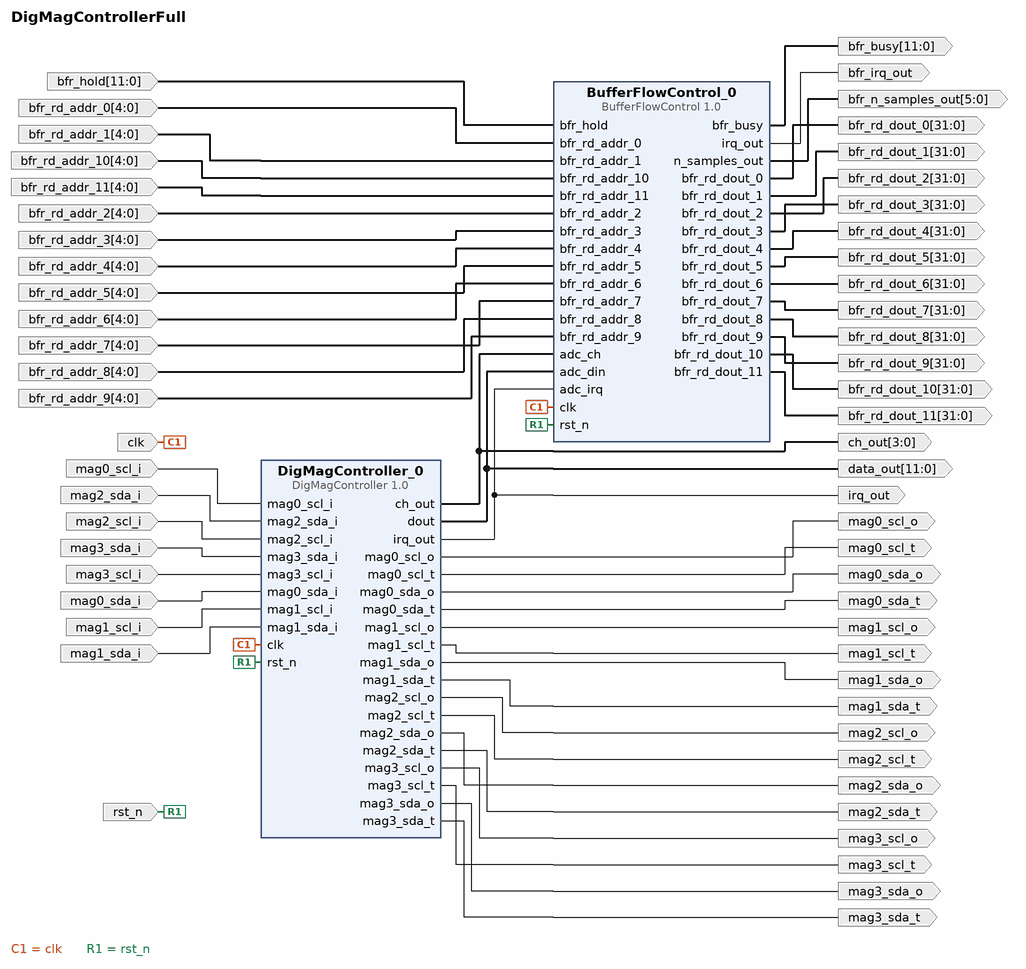
[diagram p0: block diagram of the top level]
# Vivado block design DigMagControllerFull, xczu3eg-sbva484-1-i, Vivado 2020.2
create_bd_design DigMagControllerFull

create_bd_port -dir O -from 11 -to 0 bfr_busy
create_bd_port -dir I -from 11 -to 0 bfr_hold
create_bd_port -dir O bfr_irq_out
create_bd_port -dir O -from 5 -to 0 bfr_n_samples_out
create_bd_port -dir I -from 4 -to 0 bfr_rd_addr_0
create_bd_port -dir I -from 4 -to 0 bfr_rd_addr_1
create_bd_port -dir I -from 4 -to 0 bfr_rd_addr_10
create_bd_port -dir I -from 4 -to 0 bfr_rd_addr_11
create_bd_port -dir I -from 4 -to 0 bfr_rd_addr_2
create_bd_port -dir I -from 4 -to 0 bfr_rd_addr_3
create_bd_port -dir I -from 4 -to 0 bfr_rd_addr_4
create_bd_port -dir I -from 4 -to 0 bfr_rd_addr_5
create_bd_port -dir I -from 4 -to 0 bfr_rd_addr_6
create_bd_port -dir I -from 4 -to 0 bfr_rd_addr_7
create_bd_port -dir I -from 4 -to 0 bfr_rd_addr_8
create_bd_port -dir I -from 4 -to 0 bfr_rd_addr_9
create_bd_port -dir O -from 31 -to 0 bfr_rd_dout_0
create_bd_port -dir O -from 31 -to 0 bfr_rd_dout_1
create_bd_port -dir O -from 31 -to 0 bfr_rd_dout_10
create_bd_port -dir O -from 31 -to 0 bfr_rd_dout_11
create_bd_port -dir O -from 31 -to 0 bfr_rd_dout_2
create_bd_port -dir O -from 31 -to 0 bfr_rd_dout_3
create_bd_port -dir O -from 31 -to 0 bfr_rd_dout_4
create_bd_port -dir O -from 31 -to 0 bfr_rd_dout_5
create_bd_port -dir O -from 31 -to 0 bfr_rd_dout_6
create_bd_port -dir O -from 31 -to 0 bfr_rd_dout_7
create_bd_port -dir O -from 31 -to 0 bfr_rd_dout_8
create_bd_port -dir O -from 31 -to 0 bfr_rd_dout_9
create_bd_port -dir O -from 3 -to 0 ch_out
create_bd_port -dir I -type clk clk
create_bd_port -dir O -from 11 -to 0 data_out
create_bd_port -dir O irq_out
create_bd_port -dir I -type rst rst_n
create_bd_port -dir O mag2_scl_t
create_bd_port -dir O mag2_sda_o
create_bd_port -dir O mag2_scl_o
create_bd_port -dir O mag0_scl_t
create_bd_port -dir O mag2_sda_t
create_bd_port -dir I mag0_sda_i
create_bd_port -dir I mag2_scl_i
create_bd_port -dir O mag3_sda_t
create_bd_port -dir I mag3_sda_i
create_bd_port -dir O mag0_sda_o
create_bd_port -dir O mag3_sda_o
create_bd_port -dir O mag3_scl_t
create_bd_port -dir O mag0_scl_o
create_bd_port -dir O mag3_scl_o
create_bd_port -dir O mag0_sda_t
create_bd_port -dir O mag1_sda_o
create_bd_port -dir O mag1_scl_t
create_bd_port -dir I mag0_scl_i
create_bd_port -dir O mag1_sda_t
create_bd_port -dir I mag1_sda_i
create_bd_port -dir I mag1_scl_i
create_bd_port -dir I mag2_sda_i
create_bd_port -dir O mag1_scl_o
create_bd_port -dir I mag3_scl_i

create_bd_cell -type ip -vlnv DIII:PL-Mag-Sensor:BufferFlowControl:1.0 BufferFlowControl_0
create_bd_cell -type ip -vlnv DIII:PL-Mag-Sensor:DigMagController:1.0 DigMagController_0

# ---- connections ----

connect_bd_net [get_bd_ports clk] [get_bd_pins BufferFlowControl_0/clk] [get_bd_pins DigMagController_0/clk]
connect_bd_net [get_bd_ports rst_n] [get_bd_pins BufferFlowControl_0/rst_n] [get_bd_pins DigMagController_0/rst_n]
connect_bd_net [get_bd_pins BufferFlowControl_0/bfr_busy] [get_bd_ports bfr_busy]
connect_bd_net [get_bd_pins BufferFlowControl_0/bfr_rd_dout_0] [get_bd_ports bfr_rd_dout_0]
connect_bd_net [get_bd_pins BufferFlowControl_0/bfr_rd_dout_1] [get_bd_ports bfr_rd_dout_1]
connect_bd_net [get_bd_pins BufferFlowControl_0/bfr_rd_dout_10] [get_bd_ports bfr_rd_dout_10]
connect_bd_net [get_bd_pins BufferFlowControl_0/bfr_rd_dout_11] [get_bd_ports bfr_rd_dout_11]
connect_bd_net [get_bd_pins BufferFlowControl_0/bfr_rd_dout_2] [get_bd_ports bfr_rd_dout_2]
connect_bd_net [get_bd_pins BufferFlowControl_0/bfr_rd_dout_3] [get_bd_ports bfr_rd_dout_3]
connect_bd_net [get_bd_pins BufferFlowControl_0/bfr_rd_dout_4] [get_bd_ports bfr_rd_dout_4]
connect_bd_net [get_bd_pins BufferFlowControl_0/bfr_rd_dout_5] [get_bd_ports bfr_rd_dout_5]
connect_bd_net [get_bd_pins BufferFlowControl_0/bfr_rd_dout_6] [get_bd_ports bfr_rd_dout_6]
connect_bd_net [get_bd_pins BufferFlowControl_0/bfr_rd_dout_7] [get_bd_ports bfr_rd_dout_7]
connect_bd_net [get_bd_pins BufferFlowControl_0/bfr_rd_dout_8] [get_bd_ports bfr_rd_dout_8]
connect_bd_net [get_bd_pins BufferFlowControl_0/bfr_rd_dout_9] [get_bd_ports bfr_rd_dout_9]
connect_bd_net [get_bd_pins BufferFlowControl_0/irq_out] [get_bd_ports bfr_irq_out]
connect_bd_net [get_bd_pins BufferFlowControl_0/n_samples_out] [get_bd_ports bfr_n_samples_out]
connect_bd_net [get_bd_ports bfr_hold] [get_bd_pins BufferFlowControl_0/bfr_hold]
connect_bd_net -net bfr_rd_addr_0_1 [get_bd_ports bfr_rd_addr_0] [get_bd_pins BufferFlowControl_0/bfr_rd_addr_0]
connect_bd_net -net bfr_rd_addr_1_1 [get_bd_ports bfr_rd_addr_1] [get_bd_pins BufferFlowControl_0/bfr_rd_addr_1]
connect_bd_net -net bfr_rd_addr_10_1 [get_bd_ports bfr_rd_addr_10] [get_bd_pins BufferFlowControl_0/bfr_rd_addr_10]
connect_bd_net -net bfr_rd_addr_11_1 [get_bd_ports bfr_rd_addr_11] [get_bd_pins BufferFlowControl_0/bfr_rd_addr_11]
connect_bd_net -net bfr_rd_addr_2_1 [get_bd_ports bfr_rd_addr_2] [get_bd_pins BufferFlowControl_0/bfr_rd_addr_2]
connect_bd_net -net bfr_rd_addr_3_1 [get_bd_ports bfr_rd_addr_3] [get_bd_pins BufferFlowControl_0/bfr_rd_addr_3]
connect_bd_net -net bfr_rd_addr_4_1 [get_bd_ports bfr_rd_addr_4] [get_bd_pins BufferFlowControl_0/bfr_rd_addr_4]
connect_bd_net -net bfr_rd_addr_5_1 [get_bd_ports bfr_rd_addr_5] [get_bd_pins BufferFlowControl_0/bfr_rd_addr_5]
connect_bd_net -net bfr_rd_addr_6_1 [get_bd_ports bfr_rd_addr_6] [get_bd_pins BufferFlowControl_0/bfr_rd_addr_6]
connect_bd_net -net bfr_rd_addr_7_1 [get_bd_ports bfr_rd_addr_7] [get_bd_pins BufferFlowControl_0/bfr_rd_addr_7]
connect_bd_net -net bfr_rd_addr_8_1 [get_bd_ports bfr_rd_addr_8] [get_bd_pins BufferFlowControl_0/bfr_rd_addr_8]
connect_bd_net -net bfr_rd_addr_9_1 [get_bd_ports bfr_rd_addr_9] [get_bd_pins BufferFlowControl_0/bfr_rd_addr_9]
connect_bd_net [get_bd_pins DigMagController_0/mag0_scl_o] [get_bd_ports mag0_scl_o]
connect_bd_net [get_bd_pins DigMagController_0/mag0_scl_t] [get_bd_ports mag0_scl_t]
connect_bd_net [get_bd_pins DigMagController_0/mag0_sda_o] [get_bd_ports mag0_sda_o]
connect_bd_net [get_bd_pins DigMagController_0/mag0_sda_t] [get_bd_ports mag0_sda_t]
connect_bd_net [get_bd_pins DigMagController_0/mag1_scl_o] [get_bd_ports mag1_scl_o]
connect_bd_net [get_bd_pins DigMagController_0/mag1_scl_t] [get_bd_ports mag1_scl_t]
connect_bd_net [get_bd_pins DigMagController_0/mag1_sda_o] [get_bd_ports mag1_sda_o]
connect_bd_net [get_bd_pins DigMagController_0/mag1_sda_t] [get_bd_ports mag1_sda_t]
connect_bd_net [get_bd_pins DigMagController_0/mag2_scl_o] [get_bd_ports mag2_scl_o]
connect_bd_net [get_bd_pins DigMagController_0/mag2_scl_t] [get_bd_ports mag2_scl_t]
connect_bd_net [get_bd_pins DigMagController_0/mag2_sda_o] [get_bd_ports mag2_sda_o]
connect_bd_net [get_bd_pins DigMagController_0/mag2_sda_t] [get_bd_ports mag2_sda_t]
connect_bd_net [get_bd_pins DigMagController_0/mag3_scl_o] [get_bd_ports mag3_scl_o]
connect_bd_net [get_bd_pins DigMagController_0/mag3_scl_t] [get_bd_ports mag3_scl_t]
connect_bd_net [get_bd_pins DigMagController_0/mag3_sda_o] [get_bd_ports mag3_sda_o]
connect_bd_net [get_bd_pins DigMagController_0/mag3_sda_t] [get_bd_ports mag3_sda_t]
connect_bd_net [get_bd_ports mag0_scl_i] [get_bd_pins DigMagController_0/mag0_scl_i]
connect_bd_net [get_bd_ports mag2_sda_i] [get_bd_pins DigMagController_0/mag2_sda_i]
connect_bd_net [get_bd_ports mag2_scl_i] [get_bd_pins DigMagController_0/mag2_scl_i]
connect_bd_net [get_bd_ports mag3_sda_i] [get_bd_pins DigMagController_0/mag3_sda_i]
connect_bd_net [get_bd_ports mag3_scl_i] [get_bd_pins DigMagController_0/mag3_scl_i]
connect_bd_net [get_bd_ports mag0_sda_i] [get_bd_pins DigMagController_0/mag0_sda_i]
connect_bd_net [get_bd_ports mag1_scl_i] [get_bd_pins DigMagController_0/mag1_scl_i]
connect_bd_net [get_bd_ports mag1_sda_i] [get_bd_pins DigMagController_0/mag1_sda_i]
connect_bd_net [get_bd_pins DigMagController_0/ch_out] [get_bd_ports ch_out] [get_bd_pins BufferFlowControl_0/adc_ch]
connect_bd_net [get_bd_pins DigMagController_0/dout] [get_bd_ports data_out] [get_bd_pins BufferFlowControl_0/adc_din]
connect_bd_net [get_bd_pins DigMagController_0/irq_out] [get_bd_ports irq_out] [get_bd_pins BufferFlowControl_0/adc_irq]

validate_bd_design
save_bd_design
